# Altium schematic sheet 小四轴.SchDoc
size A2
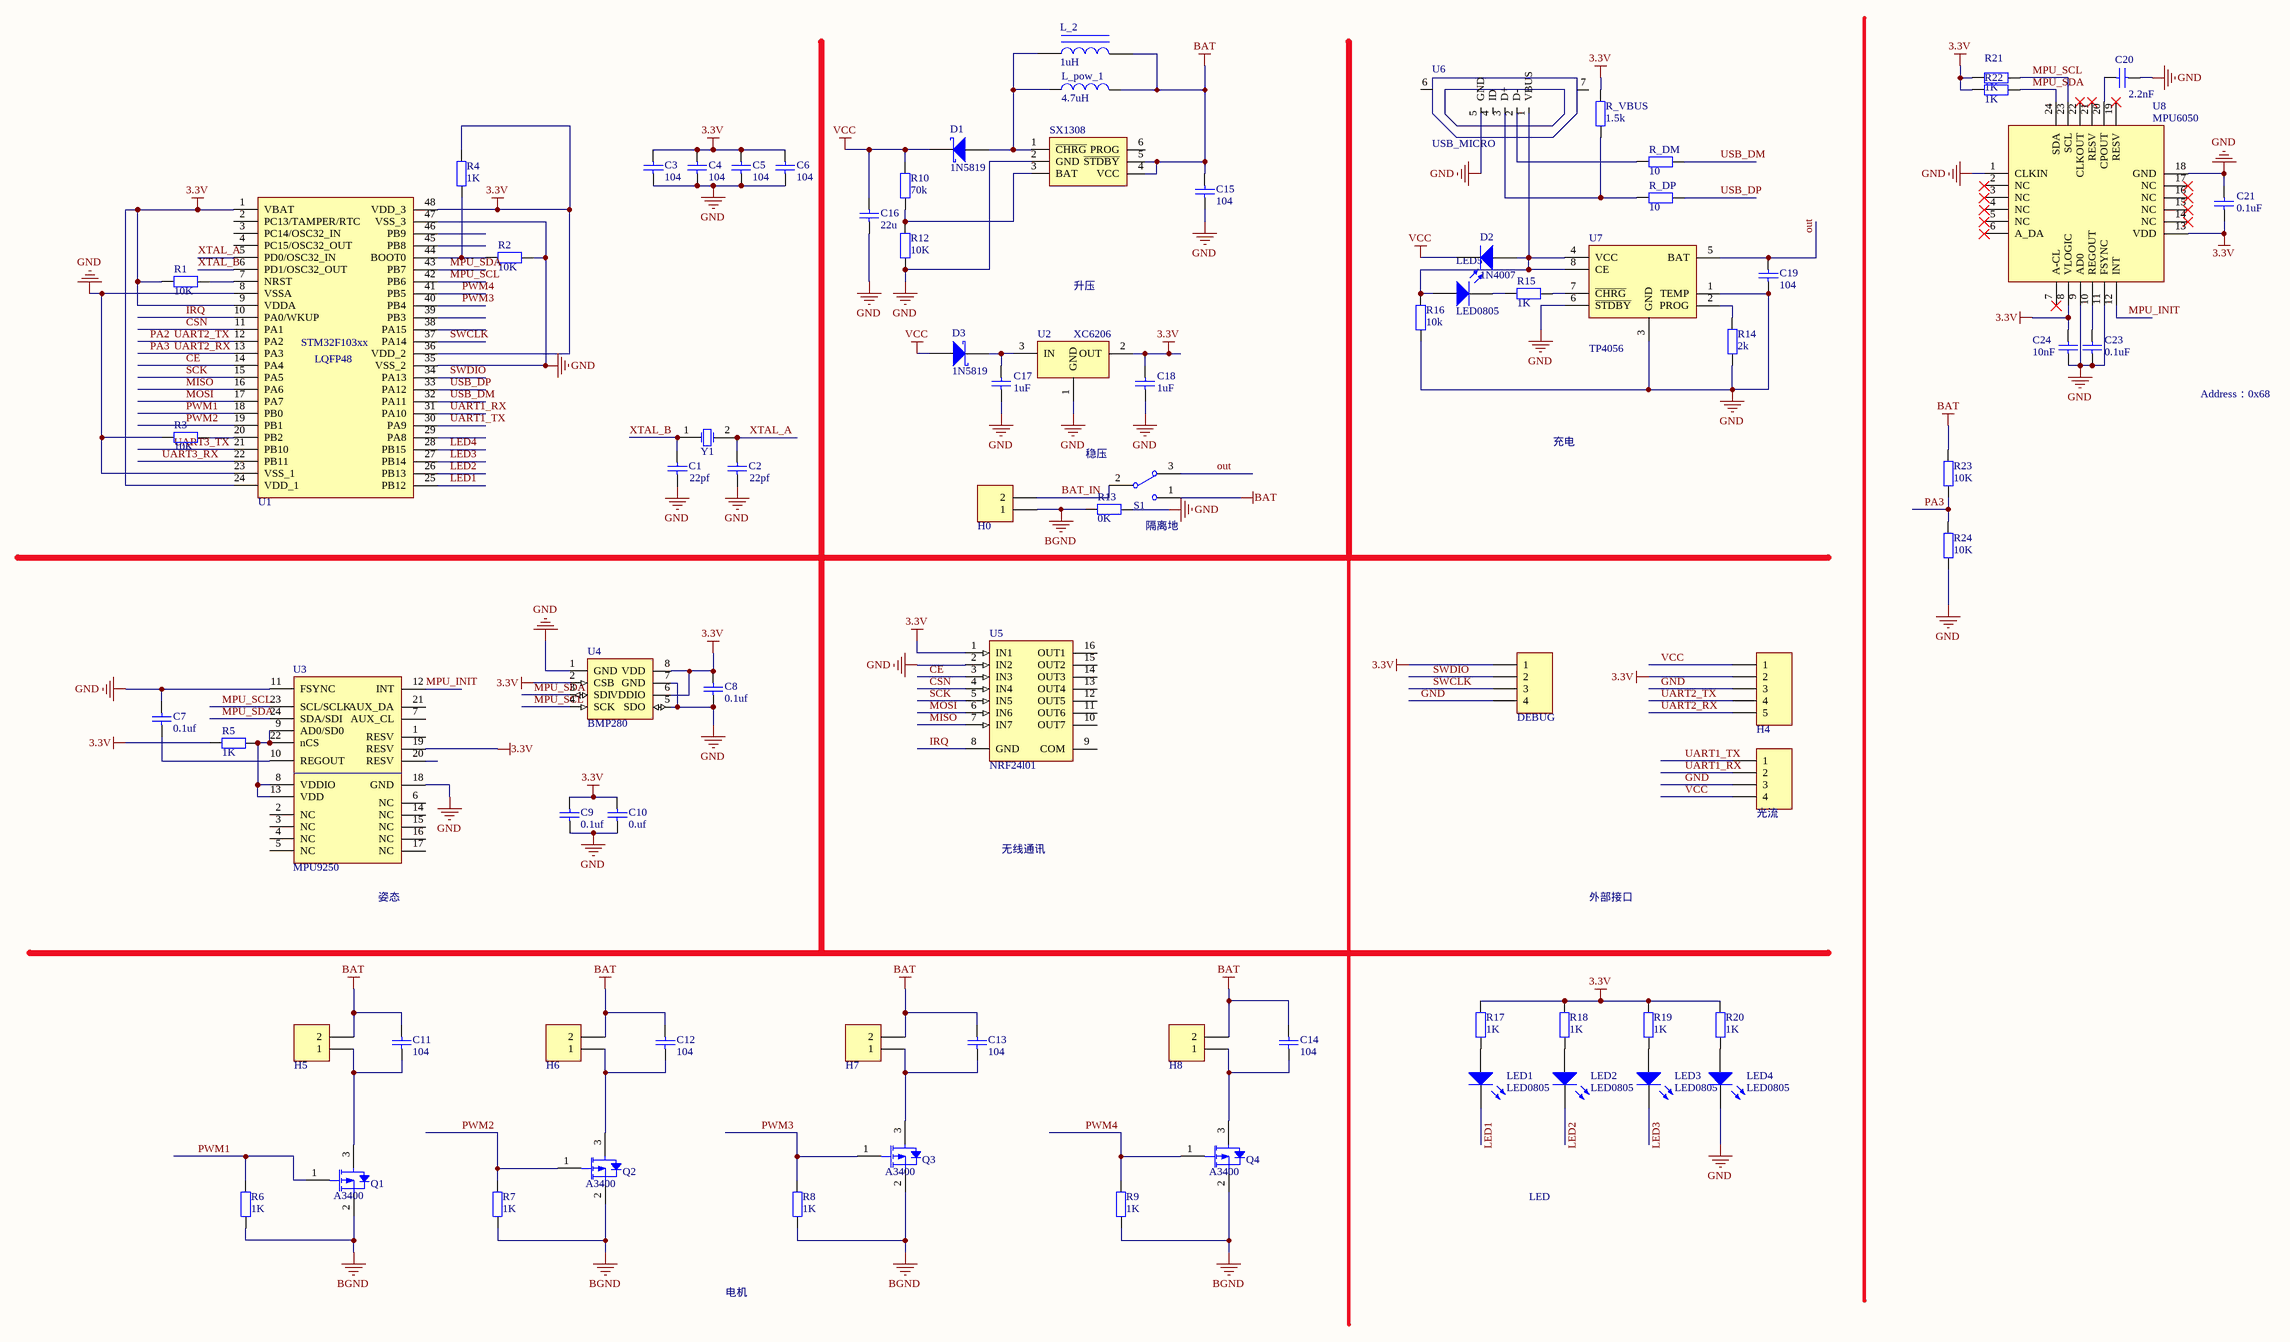
[diagram p0: 小四轴.SchDoc]

## Parts
C1  22  [0603C]  (value not drawn)
C2  104  [0603C]  (value not drawn)
C3  104  [0603C]
C4  104  [0603C]
C5  104  [0603C]
C6  104  [0603C]
C7  0.1uf  [0603C]
C8  0.1uf  [0603C]
C9  0.1uf  [0603C]
C10  0.uf  [0603C]
C11  104  [0603C]
C12  104  [0603C]
C13  104  [0603C]
C14  104  [0603C]
C15  104  [0603C]
C16  22u  [0603C]
C17  value 1uF  [C_0603]  (hidden comment: C_0603)
C18  value 1uF  [C_0603]  (hidden comment: C_0603)
C19  104  [0603C]
C20  value 2.2nF  [C_0603]  (hidden comment: C_0603)
C21  value 0.1uF  [C_0603]  (hidden comment: C_0603)
C23  value 0.1uF  [C_0603]  (hidden comment: C_0603)
C24  value 10nF  [C_0603]  (hidden comment: C_0603)
D1  1N5819  [DO214AC_SMA]
D2  1N4007  [DO214AC_SMA]
D3  1N5819  [DO214AC_SMA]
H0  Header 2  [HDR1X2]  (value not drawn)
H1  DEBUG  [HDR1X4]
H3  光流  [HDR1X4]
H4  Header 5  [HDR1X5]  (value not drawn)
H5  Header 2  [HDR1X2]  (value not drawn)
H6  Header 2  [HDR1X2]  (value not drawn)
H7  Header 2  [HDR1X2]  (value not drawn)
H8  Header 2  [HDR1X2]  (value not drawn)
L_2  1uH  [IND5X4]
L_pow_1  4.7uH  [0805L]
LED1  LED0805  [LED-0805]
LED2  LED0805  [LED-0805]
LED3  LED0805  [LED-0805]
LED4  LED0805  [LED-0805]
LED5  LED0805  [LED-0805]
Q1  A3400  [SOT23]
Q2  A3400  [SOT23]
Q3  A3400  [SOT23]
Q4  A3400  [SOT23]
R1  10K  [0603R]
R2  10K  [0603R]
R3  10K  [0603R]
R4  1K  [0603R]
R5  1K  [0603R]
R6  1K  [0603R]
R7  1K  [0603R]
R8  1K  [0603R]
R9  1K  [0603R]
R10  70k  [0603R]
R12  10K  [0603R]
R13  0K  [0603R]
R14  2k  [0603R]
R15  1K  [0603R]
R16  10k  [0603R]
R17  1K  [0805R]
R18  1K  [0805R]
R19  1K  [0805R]
R20  1K  [0805R]
R21  1K  [0603R]
R22  1K  [0603R]
R23  10K  [0603R]
R24  10K  [0603R]
R_DM  10  [0603R]
R_DP  10  [0603R]
R_VBUS  1.5k  [0603R]
S1  2档平拨开关 无支撑  [平拨2档开关100mil]  (value not drawn)
SX1308  TP4059  [SOT23-6S]  (value not drawn)
U1  STM32F103C8T6  [LQFP48_M]  (value not drawn)
U2  XC6206  [SOT-23(SOT-23-3)]
U3  MPU9250  [QFN24-0.4]
U4  BMP280  [LGA-8]
U5  NRF24l01  [NSO16_M]
U6  USB_MICRO  [USB micro]
U7  TP4056  [SOP8]
U8  MPU6050  [QFN-24_4x4x05P]
Y1  扁晶振  [Y-A-SMD]  (value not drawn)

## Nets
3.3V: C3.2 C4.2 C5.2 C6.2 C8.2 C9.2 C10.2 C18.1 C21.2 C24.2 H1.1 H4.2 R1.2 R4.1 R5.1 R17.2 R18.2 R19.2 R20.2 R21.1 R22.1 R_VBUS.1 U1.1(VBAT) U1.9(VDDA) U1.24(VDD_1) U1.36(VDD_2) U1.48(VDD_3) U2.2(OUT) U3.19(RESV) U4.2(CSB) U4.6(VDDIO) U4.8(VDD) U5.1(IN1) U8.8(VLOGIC) U8.13(VDD)
BAT: C11.2 C12.2 C13.2 C14.2 C15.2 H5.2 H6.2 H7.2 H8.2 L_2.2 L_pow_1.2 R23.2 S1.1 SX1308.4(VCC) SX1308.5(~{STDBY})
BGND: H0.1 Q1.2(S) Q2.2(S) Q3.2(S) Q4.2(S) R6.1 R7.1 R8.1 R9.1 R13.2
GND: C1.1 C2.1 C3.1 C4.1 C5.1 C6.1 C7.2 C8.1 C9.1 C10.1 C15.1 C16.1 C17.2 C18.2 C19.1 C20.1 C21.1 C23.2 C24.1 H1.4 H3.3 H4.3 LED4.2(K) R2.1 R3.2 R12.2 R13.1 R14.1 R16.1 R24.1 SX1308.2(GND) U1.8(VSSA) U1.23(VSS_1) U1.35(VSS_2) U1.47(VSS_3) U2.1(GND) U3.11(FSYNC) U3.18(GND) U4.1(GND) U4.5(SDO) U4.7(GND) U5.2(IN2) U6.5(GND) U7.1(TEMP) U7.3(GND) U7.6(~{STDBY}) U8.1(CLKIN) U8.9(AD0) U8.11(FSYNC) U8.18(GND)
VCC: C16.2 D1.2(K) D2.2(K) D3.1(A) H3.4 H4.1 R10.1
BAT_IN: H0.2 S1.2
CE: U1.14(PA4) U5.3(IN3)
CSN: U1.11(PA1) U5.4(IN4)
IRQ: U1.10(PA0/WKUP) U5.8(GND)
LED1: LED1.2(K) U1.25(PB12)
LED2: LED2.2(K) U1.26(PB13)
LED3: LED3.2(K) U1.27(PB14)
LED4: U1.28(PB15)
MISO: U1.16(PA6) U5.7(IN7)
MOSI: U1.17(PA7) U5.6(IN6)
MPU_INIT: U3.12(INT) U8.12(INT)
MPU_SCL: R21.2 U1.42(PB6) U3.23(SCL/SCLK) U4.4(SCK) U8.23(SCL)
MPU_SDA: R22.2 U1.43(PB7) U3.24(SDA/SDI) U4.3(SDI) U8.24(SDA)
out: C19.2 S1.3 U7.5(BAT)
PA2: H4.4 U1.12(PA2)  [also labelled UART2_TX]
PA3: H4.5 R23.1 R24.2 U1.13(PA3)  [also labelled UART2_RX]
PWM1: Q1.1(G) R6.2 U1.18(PB0)
PWM2: Q2.1(G) R7.2 U1.19(PB1)
PWM3: Q3.1(G) R8.2 U1.40(PB4)
PWM4: Q4.1(G) R9.2 U1.41(PB5)
SCK: U1.15(PA5) U5.5(IN5)
SWCLK: H1.3 U1.37(PA14)
SWDIO: H1.2 U1.34(PA13)
UART1_RX: H3.2 U1.31(PA10)
UART1_TX: H3.1 U1.30(PA9)
UART3_RX: U1.22(PB11)
UART3_TX: U1.21(PB10)
USB_DM: R_DM.1 U1.32(PA11)
USB_DP: R_DP.1 U1.33(PA12)
XTAL_A: C2.2 U1.5(PD0/OSC32_IN) Y1.2(OSC2)
XTAL_B: C1.2 U1.6(PD1/OSC32_OUT) Y1.1(OSC1)
NetC7_1: C7.1 U3.10(REGOUT)
NetC11_1: C11.1 H5.1 Q1.3(D)
NetC12_1: C12.1 H6.1 Q2.3(D)
NetC13_1: C13.1 H7.1 Q3.3(D)
NetC14_1: C14.1 H8.1 Q4.3(D)
NetC17_1: C17.1 D3.2(K) U2.3(IN)
NetC20_2: C20.2 U8.20(CPOUT)
NetC23_1: C23.1 U8.10(REGOUT)
NetD1_1: D1.1(A) L_2.1 L_pow_1.1 SX1308.1(~{CHRG})
NetD2_1: D2.1(A) LED5.1(A) R16.2 U6.1(VBUS) U7.4(VCC) U7.8(CE)
NetLED1_1: LED1.1(A) R17.1
NetLED2_1: LED2.1(A) R18.1
NetLED3_1: LED3.1(A) R19.1
NetLED4_1: LED4.1(A) R20.1
NetLED5_2: LED5.2(K) R15.1
NetR1_1: R1.1 U1.7(NRST)
NetR2_2: R2.2 R4.2 U1.44(BOOT0)
NetR3_1: R3.1 U1.20(PB2)
NetR5_2: R5.2 U3.8(VDDIO) U3.9(AD0/SD0) U3.13(VDD) U3.22(nCS)
NetR10_2: R10.2 R12.1 SX1308.3(BAT)
NetR14_2: R14.2 U7.2(PROG)
NetR15_2: R15.2 U7.7(~{CHRG})
NetR_DM_2: R_DM.2 U6.2(D-)
NetR_DP_2: R_DP.2 R_VBUS.2 U6.3(D+)

Not connected (* = marked no-connect by the designer): SX1308 6(PROG); U1 2(PC13/TAMPER/RTC) 3(PC14/OSC32_IN) 4(PC15/OSC32_OUT) 29(PA8) 38(PA15) 39(PB3) 45(PB8) 46(PB9); U3 1(RESV) 2(NC) 3(NC) 4(NC) 5(NC) 6(NC) 7(AUX_CL) 14(NC) 15(NC) 16(NC) 17(NC) 20(RESV) 21(AUX_DA); U5 9(COM) 10(OUT7) 11(OUT6) 12(OUT5) 13(OUT4) 14(OUT3) 15(OUT2) 16(OUT1); U6 4(ID) 6 7; U8 2(NC)* 3(NC)* 4(NC)* 5(NC)* 6(A_DA)* 7(A-CL)* 14(NC)* 15(NC)* 16(NC)* 17(NC)* 19(RESV)* 21(RESV)* 22(CLKOUT)*

## Notes on the sheet
- 升压
- Address：0x68
- 稳压
- 充电
- 隔离地
- 无线通讯
- (near U3) 姿态
- 外部接口
- LED
- 电机
- (in symbol Cap_0603) 22pf
- (in symbol STM32F103C8T6) STM32F103xx; LQFP48

## Library data of the parts
C1-C16 C19 = Cap_0603: 0603瓷片电容
D1 D3 = 1N5817-5819SMD: 贴片肖特基二极管
D2 = 1N4001-4007SMD: 贴片整流二极管
H0 H5-H8 = Header 2: Header, 2-Pin; LatestRevisionDate: 17-Jul-2002; LatestRevisionNote: Re-released for DXP Platform.; Publisher: Altium Limited
H1 H3 = Header 4: Header, 4-Pin; LatestRevisionDate: 17-Jul-2002; LatestRevisionNote: Re-released for DXP Platform.; Publisher: Altium Limited
H4 = Header 5: Header, 5-Pin; LatestRevisionDate: 17-Jul-2002; LatestRevisionNote: Re-released for DXP Platform.; Publisher: Altium Limited
L_2 = L_IND5X4: IND5X4
L_pow_1 = L_0805: 0805贴片电感
Q1-Q4 = P-MOS_SOT23: P沟道增强型场效应管
R1-R10 R12-R16 R21-R24 R_DM R_DP R_VBUS = Res_0603: 0603贴片电阻
R17-R20 = Res_0805: 0805贴片电阻
S1 = 2档平拨开关 无支撑: 2.54mm脚距 无支撑
U5 = ULN2003L: 驱动芯片; Published: 13-Oct-2000; LatestRevisionDate: 13-Apr-2006; LatestRevisionNote: IPC-7351 Footprint Added.; DatasheetVersion: 1998; PackageReference: L16; Publisher: Altium Limited; PackageDescription: 16-Pin Small Outline Integrated Circuit 1.27 mm Pitch; Code_JEDEC: MS-012-AC; Code_IPC: SOIC127P600-16; ComponentLink1Description: Manufacturer Link; ComponentLink1URL: http://www.allegromicro.com/
U7 = TP4056: 锂电池充电管理芯片
Y1 = XTAL1
C17 C18 C20 C21 C23 C24 = C_0603: Published: 8-Jun-2000; LatestRevisionDate: 17-Jul-2002; LatestRevisionNote: Re-released for DXP Platform.; PackageReference: RAD-0.3; Publisher: Altium Limited; PackageDescription: Radial Cap, Thru-Hole; 2 Leads; 0.3 in Pin Spacing
U2 = XC6206: PackageReference: SOT23-3; Published: 12-August-2017; Publisher: mazhongwei